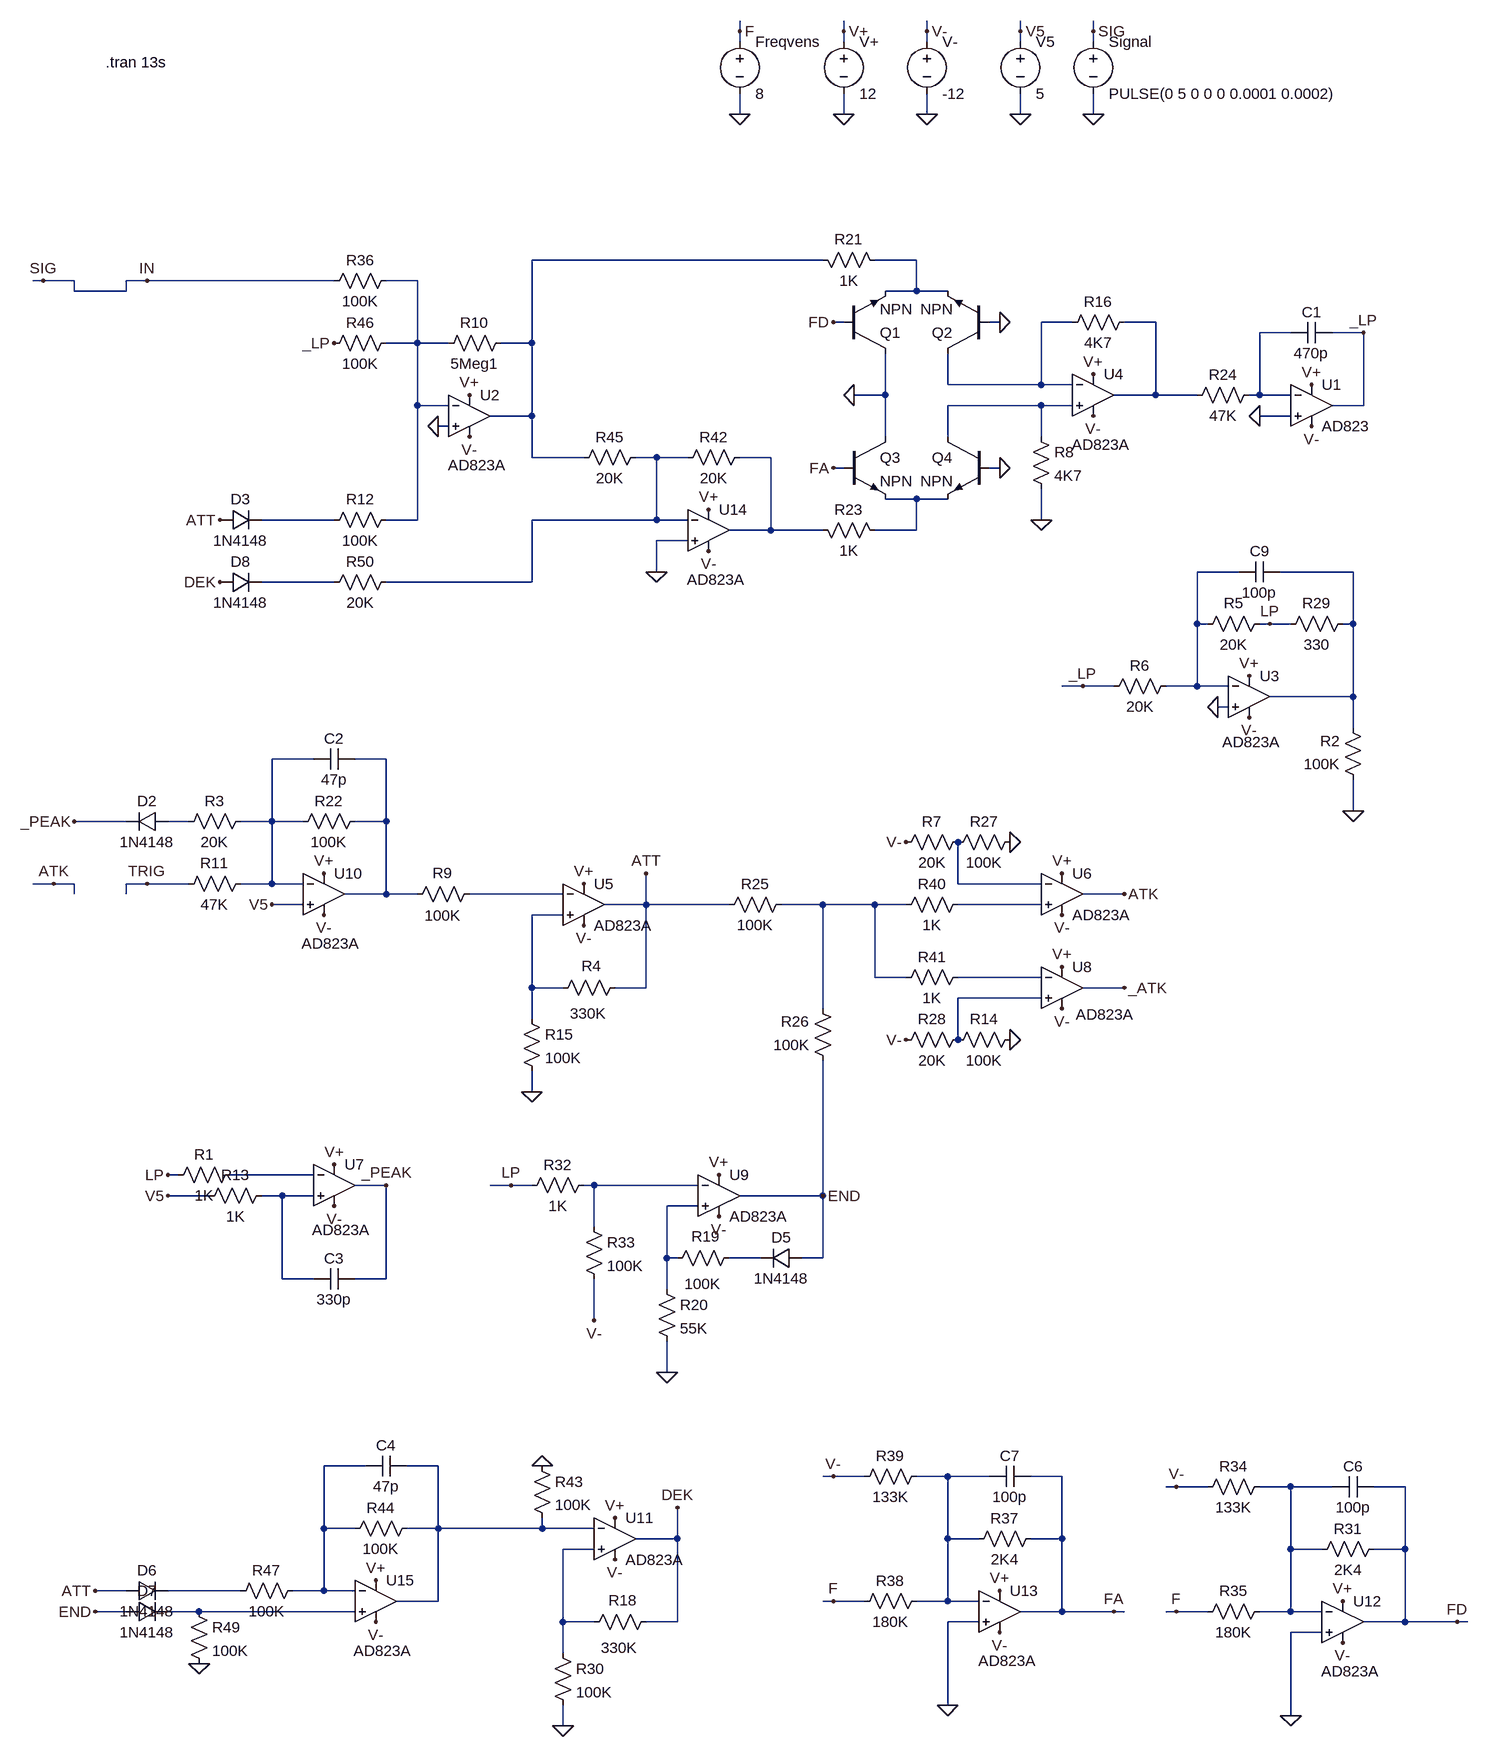
[diagram p0: schematic Function.asc]
Function.asc, the LTspice schematic file:
Version 4
SHEET 1 1408 1072
WIRE -608 -1552 -608 -1568
WIRE -448 -1552 -448 -1568
WIRE -320 -1552 -320 -1568
WIRE -176 -1552 -176 -1568
WIRE -64 -1552 -64 -1568
WIRE -608 -1536 -608 -1552
WIRE -448 -1536 -448 -1552
WIRE -320 -1536 -320 -1552
WIRE -176 -1536 -176 -1552
WIRE -64 -1536 -64 -1552
WIRE -608 -1424 -608 -1456
WIRE -448 -1424 -448 -1456
WIRE -320 -1424 -320 -1456
WIRE -176 -1424 -176 -1456
WIRE -64 -1424 -64 -1456
WIRE -480 -1200 -928 -1200
WIRE -336 -1200 -400 -1200
WIRE -1680 -1168 -1696 -1168
WIRE -1632 -1168 -1680 -1168
WIRE -1520 -1168 -1552 -1168
WIRE -1232 -1168 -1520 -1168
WIRE -1104 -1168 -1152 -1168
WIRE -1632 -1152 -1632 -1168
WIRE -1552 -1152 -1552 -1168
WIRE -1552 -1152 -1632 -1152
WIRE -336 -1152 -336 -1200
WIRE -336 -1152 -384 -1152
WIRE -288 -1152 -336 -1152
WIRE -448 -1104 -464 -1104
WIRE -208 -1104 -224 -1104
WIRE -96 -1104 -144 -1104
WIRE 32 -1104 -16 -1104
WIRE 240 -1088 192 -1088
WIRE 352 -1088 304 -1088
WIRE -1104 -1072 -1104 -1168
WIRE -1104 -1072 -1152 -1072
WIRE -1056 -1072 -1104 -1072
WIRE -928 -1072 -928 -1200
WIRE -928 -1072 -976 -1072
WIRE -288 -1008 -288 -1056
WIRE -144 -1008 -144 -1104
WIRE -144 -1008 -288 -1008
WIRE -96 -1008 -144 -1008
WIRE -384 -992 -384 -1056
WIRE -384 -992 -432 -992
WIRE 32 -992 32 -1104
WIRE 32 -992 -32 -992
WIRE 96 -992 32 -992
WIRE 192 -992 192 -1088
WIRE 192 -992 176 -992
WIRE 240 -992 192 -992
WIRE -1104 -976 -1104 -1072
WIRE -1056 -976 -1104 -976
WIRE -144 -976 -288 -976
WIRE -96 -976 -144 -976
WIRE 352 -976 352 -1088
WIRE 352 -976 304 -976
WIRE -928 -960 -928 -1072
WIRE -928 -960 -992 -960
WIRE 240 -960 192 -960
WIRE -1056 -944 -1072 -944
WIRE -384 -928 -384 -992
WIRE -288 -928 -288 -976
WIRE -144 -928 -144 -976
WIRE -928 -896 -928 -960
WIRE -848 -896 -928 -896
WIRE -736 -896 -768 -896
WIRE -688 -896 -736 -896
WIRE -560 -896 -608 -896
WIRE -448 -880 -464 -880
WIRE -208 -880 -224 -880
WIRE -336 -832 -384 -832
WIRE -288 -832 -336 -832
WIRE -1232 -800 -1344 -800
WIRE -1104 -800 -1104 -976
WIRE -1104 -800 -1152 -800
WIRE -736 -800 -736 -896
WIRE -736 -800 -928 -800
WIRE -688 -800 -736 -800
WIRE -144 -800 -144 -848
WIRE -560 -784 -560 -896
WIRE -560 -784 -624 -784
WIRE -480 -784 -560 -784
WIRE -336 -784 -336 -832
WIRE -336 -784 -400 -784
WIRE -688 -768 -736 -768
WIRE -736 -720 -736 -768
WIRE 160 -720 96 -720
WIRE 336 -720 224 -720
WIRE -1232 -704 -1344 -704
WIRE -928 -704 -928 -800
WIRE -928 -704 -1152 -704
WIRE 96 -640 96 -720
WIRE 112 -640 96 -640
WIRE 208 -640 192 -640
WIRE 240 -640 208 -640
WIRE 336 -640 336 -720
WIRE 336 -640 320 -640
WIRE -80 -544 -112 -544
WIRE -32 -544 -80 -544
WIRE 96 -544 96 -640
WIRE 96 -544 48 -544
WIRE 144 -544 96 -544
WIRE 336 -528 336 -640
WIRE 336 -528 208 -528
WIRE 144 -512 128 -512
WIRE 336 -480 336 -528
WIRE -1264 -432 -1328 -432
WIRE -1152 -432 -1200 -432
WIRE 336 -352 336 -400
WIRE -1552 -336 -1632 -336
WIRE -1456 -336 -1488 -336
WIRE -1328 -336 -1328 -432
WIRE -1328 -336 -1376 -336
WIRE -1280 -336 -1328 -336
WIRE -1152 -336 -1152 -432
WIRE -1152 -336 -1200 -336
WIRE -1664 -240 -1696 -240
WIRE -1632 -240 -1664 -240
WIRE -1520 -240 -1552 -240
WIRE -1456 -240 -1520 -240
WIRE -1328 -240 -1328 -336
WIRE -1328 -240 -1376 -240
WIRE -1280 -240 -1328 -240
WIRE -272 -240 -272 -304
WIRE -144 -240 -272 -240
WIRE -1632 -224 -1632 -240
WIRE -1552 -224 -1552 -240
WIRE -1152 -224 -1152 -336
WIRE -1152 -224 -1216 -224
WIRE -1104 -224 -1152 -224
WIRE -880 -224 -1024 -224
WIRE -16 -224 -80 -224
WIRE -1280 -208 -1328 -208
WIRE -752 -208 -752 -256
WIRE -752 -208 -816 -208
WIRE -624 -208 -752 -208
WIRE -480 -208 -544 -208
WIRE -400 -208 -480 -208
WIRE -352 -208 -400 -208
WIRE -144 -208 -272 -208
WIRE -880 -192 -928 -192
WIRE -400 -96 -400 -208
WIRE -352 -96 -400 -96
WIRE -144 -96 -272 -96
WIRE -928 -80 -928 -192
WIRE -880 -80 -928 -80
WIRE -752 -80 -752 -208
WIRE -752 -80 -800 -80
WIRE -16 -80 -80 -80
WIRE -144 -64 -272 -64
WIRE -480 -48 -480 -208
WIRE -928 -32 -928 -80
WIRE -272 0 -272 -64
WIRE -928 80 -928 48
WIRE -1472 208 -1488 208
WIRE -1264 208 -1392 208
WIRE -1152 224 -1200 224
WIRE -960 224 -992 224
WIRE -928 224 -960 224
WIRE -832 224 -848 224
WIRE -672 224 -832 224
WIRE -1424 240 -1488 240
WIRE -1312 240 -1344 240
WIRE -1264 240 -1312 240
WIRE -480 240 -480 32
WIRE -480 240 -608 240
WIRE -672 256 -720 256
WIRE -832 288 -832 224
WIRE -720 336 -720 256
WIRE -704 336 -720 336
WIRE -576 336 -624 336
WIRE -480 336 -480 240
WIRE -480 336 -512 336
WIRE -1312 368 -1312 240
WIRE -1264 368 -1312 368
WIRE -1152 368 -1152 224
WIRE -1152 368 -1200 368
WIRE -720 384 -720 336
WIRE -832 432 -832 368
WIRE -720 512 -720 464
WIRE -1184 656 -1248 656
WIRE -1072 656 -1120 656
WIRE -464 672 -480 672
WIRE -416 672 -464 672
WIRE -288 672 -336 672
WIRE -224 672 -288 672
WIRE -112 672 -160 672
WIRE 64 688 48 688
WIRE 112 688 64 688
WIRE 240 688 192 688
WIRE 304 688 240 688
WIRE 416 688 368 688
WIRE -1248 752 -1248 656
WIRE -1200 752 -1248 752
WIRE -1072 752 -1072 656
WIRE -1072 752 -1120 752
WIRE -912 752 -912 736
WIRE -912 752 -1072 752
WIRE -832 752 -912 752
WIRE -704 768 -704 720
WIRE -704 768 -768 768
WIRE -288 768 -288 672
WIRE -240 768 -288 768
WIRE -112 768 -112 672
WIRE -112 768 -160 768
WIRE -832 784 -880 784
WIRE 240 784 240 688
WIRE 288 784 240 784
WIRE 416 784 416 688
WIRE 416 784 368 784
WIRE -1552 848 -1600 848
WIRE -1376 848 -1488 848
WIRE -1248 848 -1248 752
WIRE -1248 848 -1296 848
WIRE -1200 848 -1248 848
WIRE -1072 864 -1072 752
WIRE -1072 864 -1136 864
WIRE -464 864 -480 864
WIRE -416 864 -464 864
WIRE -288 864 -288 768
WIRE -288 864 -336 864
WIRE -240 864 -288 864
WIRE -1552 880 -1600 880
WIRE -1440 880 -1488 880
WIRE -1200 880 -1440 880
WIRE -112 880 -112 768
WIRE -112 880 -176 880
WIRE -32 880 -112 880
WIRE -16 880 -32 880
WIRE 64 880 48 880
WIRE 112 880 64 880
WIRE 240 880 240 784
WIRE 240 880 192 880
WIRE 288 880 240 880
WIRE -880 896 -880 784
WIRE -832 896 -880 896
WIRE -704 896 -704 768
WIRE -704 896 -752 896
WIRE -240 896 -288 896
WIRE 416 896 416 784
WIRE 416 896 352 896
WIRE 496 896 416 896
WIRE 512 896 496 896
WIRE 288 912 240 912
WIRE -880 944 -880 896
WIRE -288 1024 -288 896
WIRE 240 1040 240 912
WIRE -880 1056 -880 1024
FLAG -448 -1424 0
FLAG -64 -1424 0
FLAG -320 -1424 0
FLAG -176 -1424 0
FLAG 128 -512 0
FLAG 208 -640 LP
FLAG -448 -1552 V+
FLAG -320 -1552 V-
FLAG 272 -1008 V+
FLAG -176 -1552 V5
FLAG 272 -944 V-
FLAG 176 -496 V-
FLAG -1024 -928 V-
FLAG 176 -560 V+
FLAG -1024 -992 V+
FLAG -1520 -1168 IN
FLAG -1248 -192 V-
FLAG -1248 -256 V+
FLAG -848 -240 V+
FLAG -1232 192 V+
FLAG -64 -1552 SIG
FLAG 352 -1088 _LP
FLAG -80 -544 _LP
FLAG -1488 208 LP
FLAG -640 208 V+
FLAG -720 512 0
FLAG -480 240 END
FLAG -832 432 V-
FLAG -960 224 LP
FLAG -1520 -240 TRIG
FLAG -752 -256 ATT
FLAG -1408 -800 ATT
FLAG -16 -80 _ATK
FLAG -16 -224 ATK
FLAG -1488 240 V5
FLAG -1664 -240 ATK
FLAG -1680 -1168 SIG
FLAG -208 -1104 0
FLAG -608 -1424 0
FLAG -608 -1552 F
FLAG -464 -1104 FD
FLAG -64 -960 V-
FLAG -64 -1024 V+
FLAG -208 -880 0
FLAG -464 -880 FA
FLAG -144 -800 0
FLAG -432 -992 0
FLAG 320 928 V-
FLAG 320 864 V+
FLAG 240 1040 0
FLAG 64 880 F
FLAG 496 896 FD
FLAG 64 688 V-
FLAG -208 912 V-
FLAG -208 848 V+
FLAG -288 1024 0
FLAG -464 864 F
FLAG -464 672 V-
FLAG -32 880 FA
FLAG -112 -256 V+
FLAG -112 -192 V-
FLAG -112 -112 V+
FLAG -112 -48 V-
FLAG -656 -752 V-
FLAG -656 -816 V+
FLAG -736 -720 0
FLAG -1232 -1072 _LP
FLAG 336 -352 0
FLAG -848 -176 V-
FLAG -928 80 0
FLAG -1232 256 V-
FLAG -800 736 V+
FLAG -704 720 DEK
FLAG -800 800 V-
FLAG -880 1056 0
FLAG -1600 848 ATT
FLAG -912 656 0
FLAG -1168 896 V-
FLAG -1168 832 V+
FLAG -1600 880 END
FLAG -640 272 V-
FLAG -1440 960 0
FLAG -1152 224 _PEAK
FLAG -1408 -704 DEK
FLAG -1328 -208 V5
FLAG -1632 -336 _PEAK
FLAG 192 -960 0
FLAG -1072 -944 0
FLAG -352 0 V-
FLAG -352 -304 V-
FLAG -192 0 0
FLAG -192 -304 0
SYMBOL voltage -448 -1552 R0
SYMATTR InstName V+
SYMATTR Value 12
SYMBOL voltage -64 -1552 R0
SYMATTR InstName Signal
SYMATTR Value PULSE(0 5 0 0 0 0.0001 0.0002)
SYMBOL voltage -320 -1552 R0
SYMATTR InstName V-
SYMATTR Value -12
SYMBOL Cap 304 -1104 R90
WINDOW 0 0 32 VBottom 2
WINDOW 3 32 32 VTop 2
SYMATTR InstName C1
SYMATTR Value 470p
SYMBOL Res -960 -1088 R90
WINDOW 0 0 56 VBottom 2
WINDOW 3 32 56 VTop 2
SYMATTR InstName R10
SYMATTR Value 5Meg1
SYMBOL OpAmps/AD823A -1024 -1024 R0
WINDOW 3 -33 140 Left 2
SYMATTR InstName U2
SYMBOL voltage -176 -1552 R0
SYMATTR InstName V5
SYMATTR Value 5
SYMBOL OpAmps/AD823A 176 -592 R0
WINDOW 3 -41 134 Left 2
SYMATTR InstName U3
SYMBOL Res 352 -384 R180
WINDOW 0 36 76 Left 2
WINDOW 3 36 40 Left 2
SYMATTR InstName R2
SYMATTR Value 100K
SYMBOL Res 208 -656 R90
WINDOW 0 0 56 VBottom 2
WINDOW 3 32 56 VTop 2
SYMATTR InstName R5
SYMATTR Value 20K
SYMBOL Res 64 -560 R90
WINDOW 0 0 56 VBottom 2
WINDOW 3 32 56 VTop 2
SYMATTR InstName R6
SYMATTR Value 20K
SYMBOL OpAmps/AD823A -848 -272 R0
SYMATTR InstName U5
SYMBOL Res -784 -96 R90
WINDOW 0 -2 52 VBottom 2
WINDOW 3 40 57 VTop 2
SYMATTR InstName R4
SYMATTR Value 330K
SYMBOL Res -1008 -240 R90
WINDOW 0 -1 57 VBottom 2
WINDOW 3 33 57 VTop 2
SYMATTR InstName R9
SYMATTR Value 100K
SYMBOL OpAmps/AD823A -1232 160 R0
WINDOW 3 -34 133 Left 2
SYMATTR InstName U7
SYMBOL Res -1440 256 R270
WINDOW 0 32 56 VTop 2
WINDOW 3 0 56 VBottom 2
SYMATTR InstName R13
SYMATTR Value 1K
SYMBOL OpAmps/AD823A -1248 -288 R0
WINDOW 3 -34 140 Left 2
SYMATTR InstName U10
SYMBOL Res -1184 -352 R90
WINDOW 0 0 56 VBottom 2
WINDOW 3 32 56 VTop 2
SYMATTR InstName R22
SYMATTR Value 100K
SYMBOL Res -1136 -816 R90
WINDOW 0 0 56 VBottom 2
WINDOW 3 32 56 VTop 2
SYMATTR InstName R12
SYMATTR Value 100K
SYMBOL Res 224 -624 R270
WINDOW 0 32 56 VTop 2
WINDOW 3 0 56 VBottom 2
SYMATTR InstName R29
SYMATTR Value 330
SYMBOL Cap -1200 -448 R90
WINDOW 0 0 32 VBottom 2
WINDOW 3 32 32 VTop 2
SYMATTR InstName C2
SYMATTR Value 47p
SYMBOL OpAmps/AD823A -640 176 R0
SYMATTR InstName U9
SYMBOL Res -608 320 R90
WINDOW 0 -2 52 VBottom 2
WINDOW 3 40 57 VTop 2
SYMATTR InstName R19
SYMATTR Value 100K
SYMBOL Res -736 368 R0
SYMATTR InstName R20
SYMATTR Value 55K
SYMBOL Res -832 208 R90
WINDOW 0 0 56 VBottom 2
WINDOW 3 32 56 VTop 2
SYMATTR InstName R32
SYMATTR Value 1K
SYMBOL Res -848 272 R0
SYMATTR InstName R33
SYMATTR Value 100K
SYMBOL Res -1360 -256 R90
WINDOW 0 0 56 VBottom 2
WINDOW 3 32 56 VTop 2
SYMATTR InstName R11
SYMATTR Value 47K
SYMBOL Res -944 -48 R0
SYMATTR InstName R15
SYMATTR Value 100K
SYMBOL Res -384 -768 M270
WINDOW 0 32 56 VTop 2
WINDOW 3 0 56 VBottom 2
SYMATTR InstName R23
SYMATTR Value 1K
SYMBOL npn -448 -1056 M180
SYMATTR InstName Q1
SYMBOL npn -224 -1056 R180
SYMATTR InstName Q2
SYMBOL voltage -608 -1552 R0
SYMATTR InstName Freqvens
SYMATTR Value 8
SYMBOL Res -1360 -352 R90
WINDOW 0 0 56 VBottom 2
WINDOW 3 32 56 VTop 2
SYMATTR InstName R3
SYMATTR Value 20K
SYMBOL Res 0 -1120 R90
WINDOW 0 0 56 VBottom 2
WINDOW 3 32 56 VTop 2
SYMATTR InstName R16
SYMATTR Value 4K7
SYMBOL OpAmps/AD823A -64 -1056 R0
WINDOW 3 -33 140 Left 2
SYMATTR InstName U4
SYMBOL npn -448 -928 R0
SYMATTR InstName Q3
SYMBOL npn -224 -928 M0
SYMATTR InstName Q4
SYMBOL Res -384 -1184 M270
WINDOW 0 32 56 VTop 2
WINDOW 3 0 56 VBottom 2
SYMATTR InstName R21
SYMATTR Value 1K
SYMBOL Res 192 -1008 R90
WINDOW 0 0 56 VBottom 2
WINDOW 3 32 56 VTop 2
SYMATTR InstName R24
SYMATTR Value 47K
SYMBOL Res -1136 -1184 R90
WINDOW 0 0 56 VBottom 2
WINDOW 3 32 56 VTop 2
SYMATTR InstName R36
SYMATTR Value 100K
SYMBOL Res -160 -944 R0
SYMATTR InstName R8
SYMATTR Value 4K7
SYMBOL Res -528 -224 R90
WINDOW 0 0 56 VBottom 2
WINDOW 3 32 56 VTop 2
SYMATTR InstName R25
SYMATTR Value 100K
SYMBOL Res -464 48 R180
WINDOW 0 36 76 Left 2
WINDOW 3 36 40 Left 2
SYMATTR InstName R26
SYMATTR Value 100K
SYMBOL Res 384 768 R90
WINDOW 0 0 56 VBottom 2
WINDOW 3 32 56 VTop 2
SYMATTR InstName R31
SYMATTR Value 2K4
SYMBOL OpAmps/AD823A 320 832 R0
WINDOW 3 -33 140 Left 2
SYMATTR InstName U12
SYMBOL Cap 368 672 R90
WINDOW 0 0 32 VBottom 2
WINDOW 3 32 32 VTop 2
SYMATTR InstName C6
SYMATTR Value 100p
SYMBOL Res 208 864 R90
WINDOW 0 0 56 VBottom 2
WINDOW 3 32 56 VTop 2
SYMATTR InstName R35
SYMATTR Value 180K
SYMBOL Res 208 672 R90
WINDOW 0 0 56 VBottom 2
WINDOW 3 32 56 VTop 2
SYMATTR InstName R34
SYMATTR Value 133K
SYMBOL Res -144 752 R90
WINDOW 0 0 56 VBottom 2
WINDOW 3 32 56 VTop 2
SYMATTR InstName R37
SYMATTR Value 2K4
SYMBOL OpAmps/AD823A -208 816 R0
WINDOW 3 -33 140 Left 2
SYMATTR InstName U13
SYMBOL Cap -160 656 R90
WINDOW 0 0 32 VBottom 2
WINDOW 3 32 32 VTop 2
SYMATTR InstName C7
SYMATTR Value 100p
SYMBOL Res -320 848 R90
WINDOW 0 0 56 VBottom 2
WINDOW 3 32 56 VTop 2
SYMATTR InstName R38
SYMATTR Value 180K
SYMBOL Res -320 656 R90
WINDOW 0 0 56 VBottom 2
WINDOW 3 32 56 VTop 2
SYMATTR InstName R39
SYMATTR Value 133K
SYMBOL OpAmps/AD823A -112 -288 R0
SYMATTR InstName U6
SYMBOL Res -288 -288 R270
WINDOW 0 32 56 VTop 2
WINDOW 3 0 56 VBottom 2
SYMATTR InstName R27
SYMATTR Value 100K
SYMBOL Res -368 -288 R270
WINDOW 0 32 56 VTop 2
WINDOW 3 0 56 VBottom 2
SYMATTR InstName R7
SYMATTR Value 20K
SYMBOL OpAmps/AD823A -112 -144 R0
WINDOW 3 21 105 Left 2
SYMATTR InstName U8
SYMBOL Res -288 16 R270
WINDOW 0 32 56 VTop 2
WINDOW 3 0 56 VBottom 2
SYMATTR InstName R14
SYMATTR Value 100K
SYMBOL Res -368 16 R270
WINDOW 0 32 56 VTop 2
WINDOW 3 0 56 VBottom 2
SYMATTR InstName R28
SYMATTR Value 20K
SYMBOL Res -256 -224 R90
WINDOW 0 0 56 VBottom 2
WINDOW 3 32 56 VTop 2
SYMATTR InstName R40
SYMATTR Value 1K
SYMBOL Res -256 -112 R90
WINDOW 0 0 56 VBottom 2
WINDOW 3 32 56 VTop 2
SYMATTR InstName R41
SYMATTR Value 1K
SYMBOL Res -592 -912 R90
WINDOW 0 0 56 VBottom 2
WINDOW 3 32 56 VTop 2
SYMATTR InstName R42
SYMATTR Value 20K
SYMBOL OpAmps/AD823A -656 -848 R0
WINDOW 3 -33 140 Left 2
SYMATTR InstName U14
SYMBOL Res -752 -912 R90
WINDOW 0 0 56 VBottom 2
WINDOW 3 32 56 VTop 2
SYMATTR InstName R45
SYMATTR Value 20K
SYMBOL Cap 224 -736 R90
WINDOW 0 0 32 VBottom 2
WINDOW 3 32 32 VTop 2
SYMATTR InstName C9
SYMATTR Value 100p
SYMBOL Res -1136 -1088 R90
WINDOW 0 0 56 VBottom 2
WINDOW 3 32 56 VTop 2
SYMATTR InstName R46
SYMATTR Value 100K
SYMBOL Cap -1200 352 R90
WINDOW 0 0 32 VBottom 2
WINDOW 3 32 32 VTop 2
SYMATTR InstName C3
SYMATTR Value 330p
SYMBOL diode -1488 -352 R90
WINDOW 0 0 32 VBottom 2
WINDOW 3 32 32 VTop 2
SYMATTR InstName D2
SYMATTR Value 1N4148
SYMBOL Res -1376 192 R90
WINDOW 0 0 56 VBottom 2
WINDOW 3 32 56 VTop 2
SYMATTR InstName R1
SYMATTR Value 1K
SYMBOL diode -1408 -784 R270
WINDOW 0 32 32 VTop 2
WINDOW 3 0 32 VBottom 2
SYMATTR InstName D3
SYMATTR Value 1N4148
SYMBOL OpAmps/AD823 272 -1040 R0
SYMATTR InstName U1
SYMBOL OpAmps/AD823A -800 704 R0
SYMATTR InstName U11
SYMBOL Res -736 880 R90
WINDOW 0 -2 52 VBottom 2
WINDOW 3 40 57 VTop 2
SYMATTR InstName R18
SYMATTR Value 330K
SYMBOL Res -896 928 R0
SYMATTR InstName R30
SYMATTR Value 100K
SYMBOL Res -928 640 R0
SYMATTR InstName R43
SYMATTR Value 100K
SYMBOL OpAmps/AD823A -1168 800 R0
WINDOW 3 -34 140 Left 2
SYMATTR InstName U15
SYMBOL Res -1104 736 R90
WINDOW 0 0 56 VBottom 2
WINDOW 3 32 56 VTop 2
SYMATTR InstName R44
SYMATTR Value 100K
SYMBOL Cap -1120 640 R90
WINDOW 0 0 32 VBottom 2
WINDOW 3 32 32 VTop 2
SYMATTR InstName C4
SYMATTR Value 47p
SYMBOL Res -1280 832 R90
WINDOW 0 0 56 VBottom 2
WINDOW 3 32 56 VTop 2
SYMATTR InstName R47
SYMATTR Value 100K
SYMBOL diode -512 320 R90
WINDOW 0 0 32 VBottom 2
WINDOW 3 32 32 VTop 2
SYMATTR InstName D5
SYMATTR Value 1N4148
SYMBOL diode -1552 864 R270
WINDOW 0 32 32 VTop 2
WINDOW 3 0 32 VBottom 2
SYMATTR InstName D6
SYMATTR Value 1N4148
SYMBOL Res -1456 864 R0
SYMATTR InstName R49
SYMATTR Value 100K
SYMBOL diode -1552 896 R270
WINDOW 0 32 32 VTop 2
WINDOW 3 0 32 VBottom 2
SYMATTR InstName D7
SYMATTR Value 1N4148
SYMBOL Res -1136 -720 R90
WINDOW 0 0 56 VBottom 2
WINDOW 3 32 56 VTop 2
SYMATTR InstName R50
SYMATTR Value 20K
SYMBOL diode -1408 -688 R270
WINDOW 0 32 32 VTop 2
WINDOW 3 0 32 VBottom 2
SYMATTR InstName D8
SYMATTR Value 1N4148
TEXT -1584 -1504 Left 2 !.tran 13s

The netlist it stands for:
* Function.asc
V+ V+ 0 12
V§Signal SIG 0 PULSE(0 5 0 0 0 0.0001 0.0002)
V- V- 0 -12
C1 _LP N006 470p
R10 N001 N003 5Meg1
XU2 0 N003 V+ V- N001 AD823A  ; pins In+ In- V+ V- OUT
V5 V5 0 5
XU3 0 N012 V+ V- N013 AD823A  ; pins In+ In- V+ V- OUT
R2 0 N013 100K
R5 LP N012 20K
R6 N012 _LP 20K
XU5 N022 N019 V+ V- ATT AD823A  ; pins In+ In- V+ V- OUT
R4 ATT N022 330K
R9 N019 N016 100K
XU7 N027 N025 V+ V- _PEAK AD823A  ; pins In+ In- V+ V- OUT
R13 V5 N027 1K
XU10 V5 N015 V+ V- N016 AD823A  ; pins In+ In- V+ V- OUT
R22 N016 N015 100K
R12 N003 N011 100K
R29 LP N013 330
C2 N016 N015 47p
XU9 N028 N026 V+ V- END AD823A  ; pins In+ In- V+ V- OUT
R19 N029 N028 100K
R20 N028 0 55K
R32 N026 LP 1K
R33 N026 V- 100K
R11 N015 TRIG 47K
R15 N022 0 100K
R23 N010 N009 1K
Q1 0 FD N002 0 NPN
Q2 N004 0 N002 0 NPN
V§Freqvens F 0 8
R3 N015 N017 20K
R16 N005 N004 4K7
XU4 N007 N004 V+ V- N005 AD823A  ; pins In+ In- V+ V- OUT
Q3 0 FA N010 0 NPN
Q4 N007 0 N010 0 NPN
R21 N002 N001 1K
R24 N006 N005 47K
R36 N003 SIG 100K
R8 N007 0 4K7
R25 N020 ATT 100K
R26 END N020 100K
R31 FD N033 2K4
XU12 0 N033 V+ V- FD AD823A  ; pins In+ In- V+ V- OUT
C6 FD N033 100p
R35 N033 F 180K
R34 N033 V- 133K
R37 FA N032 2K4
XU13 0 N032 V+ V- FA AD823A  ; pins In+ In- V+ V- OUT
C7 FA N032 100p
R38 N032 F 180K
R39 N032 V- 133K
XU6 N021 N018 V+ V- ATK AD823A  ; pins In+ In- V+ V- OUT
R27 N018 0 100K
R7 V- N018 20K
XU8 N024 N023 V+ V- _ATK AD823A  ; pins In+ In- V+ V- OUT
R14 N024 0 100K
R28 V- N024 20K
R40 N021 N020 1K
R41 N023 N020 1K
R42 N009 N008 20K
XU14 0 N008 V+ V- N009 AD823A  ; pins In+ In- V+ V- OUT
R45 N008 N001 20K
C9 N013 N012 100p
R46 N003 _LP 100K
C3 _PEAK N027 330p
D2 N017 _PEAK 1N4148
R1 N025 LP 1K
D3 ATT N011 1N4148
XU1 0 N006 V+ V- _LP AD823  ; pins In+ In- V+ V- OUT
XU11 N034 N031 V+ V- DEK AD823A  ; pins In+ In- V+ V- OUT
R18 DEK N034 330K
R30 N034 0 100K
R43 0 N031 100K
XU15 N036 N030 V+ V- N031 AD823A  ; pins In+ In- V+ V- OUT
R44 N031 N030 100K
C4 N031 N030 47p
R47 N030 N035 100K
D5 END N029 1N4148
D6 ATT N035 1N4148
R49 N036 0 100K
D7 END N036 1N4148
R50 N008 N014 20K
D8 DEK N014 1N4148
.model D D
.lib standard.dio
.model NPN NPN
.model PNP PNP
.lib standard.bjt
.tran 13s
.lib ADI.lib
.backanno
.end